# Altium project eth_bridge_v2.PrjPcb
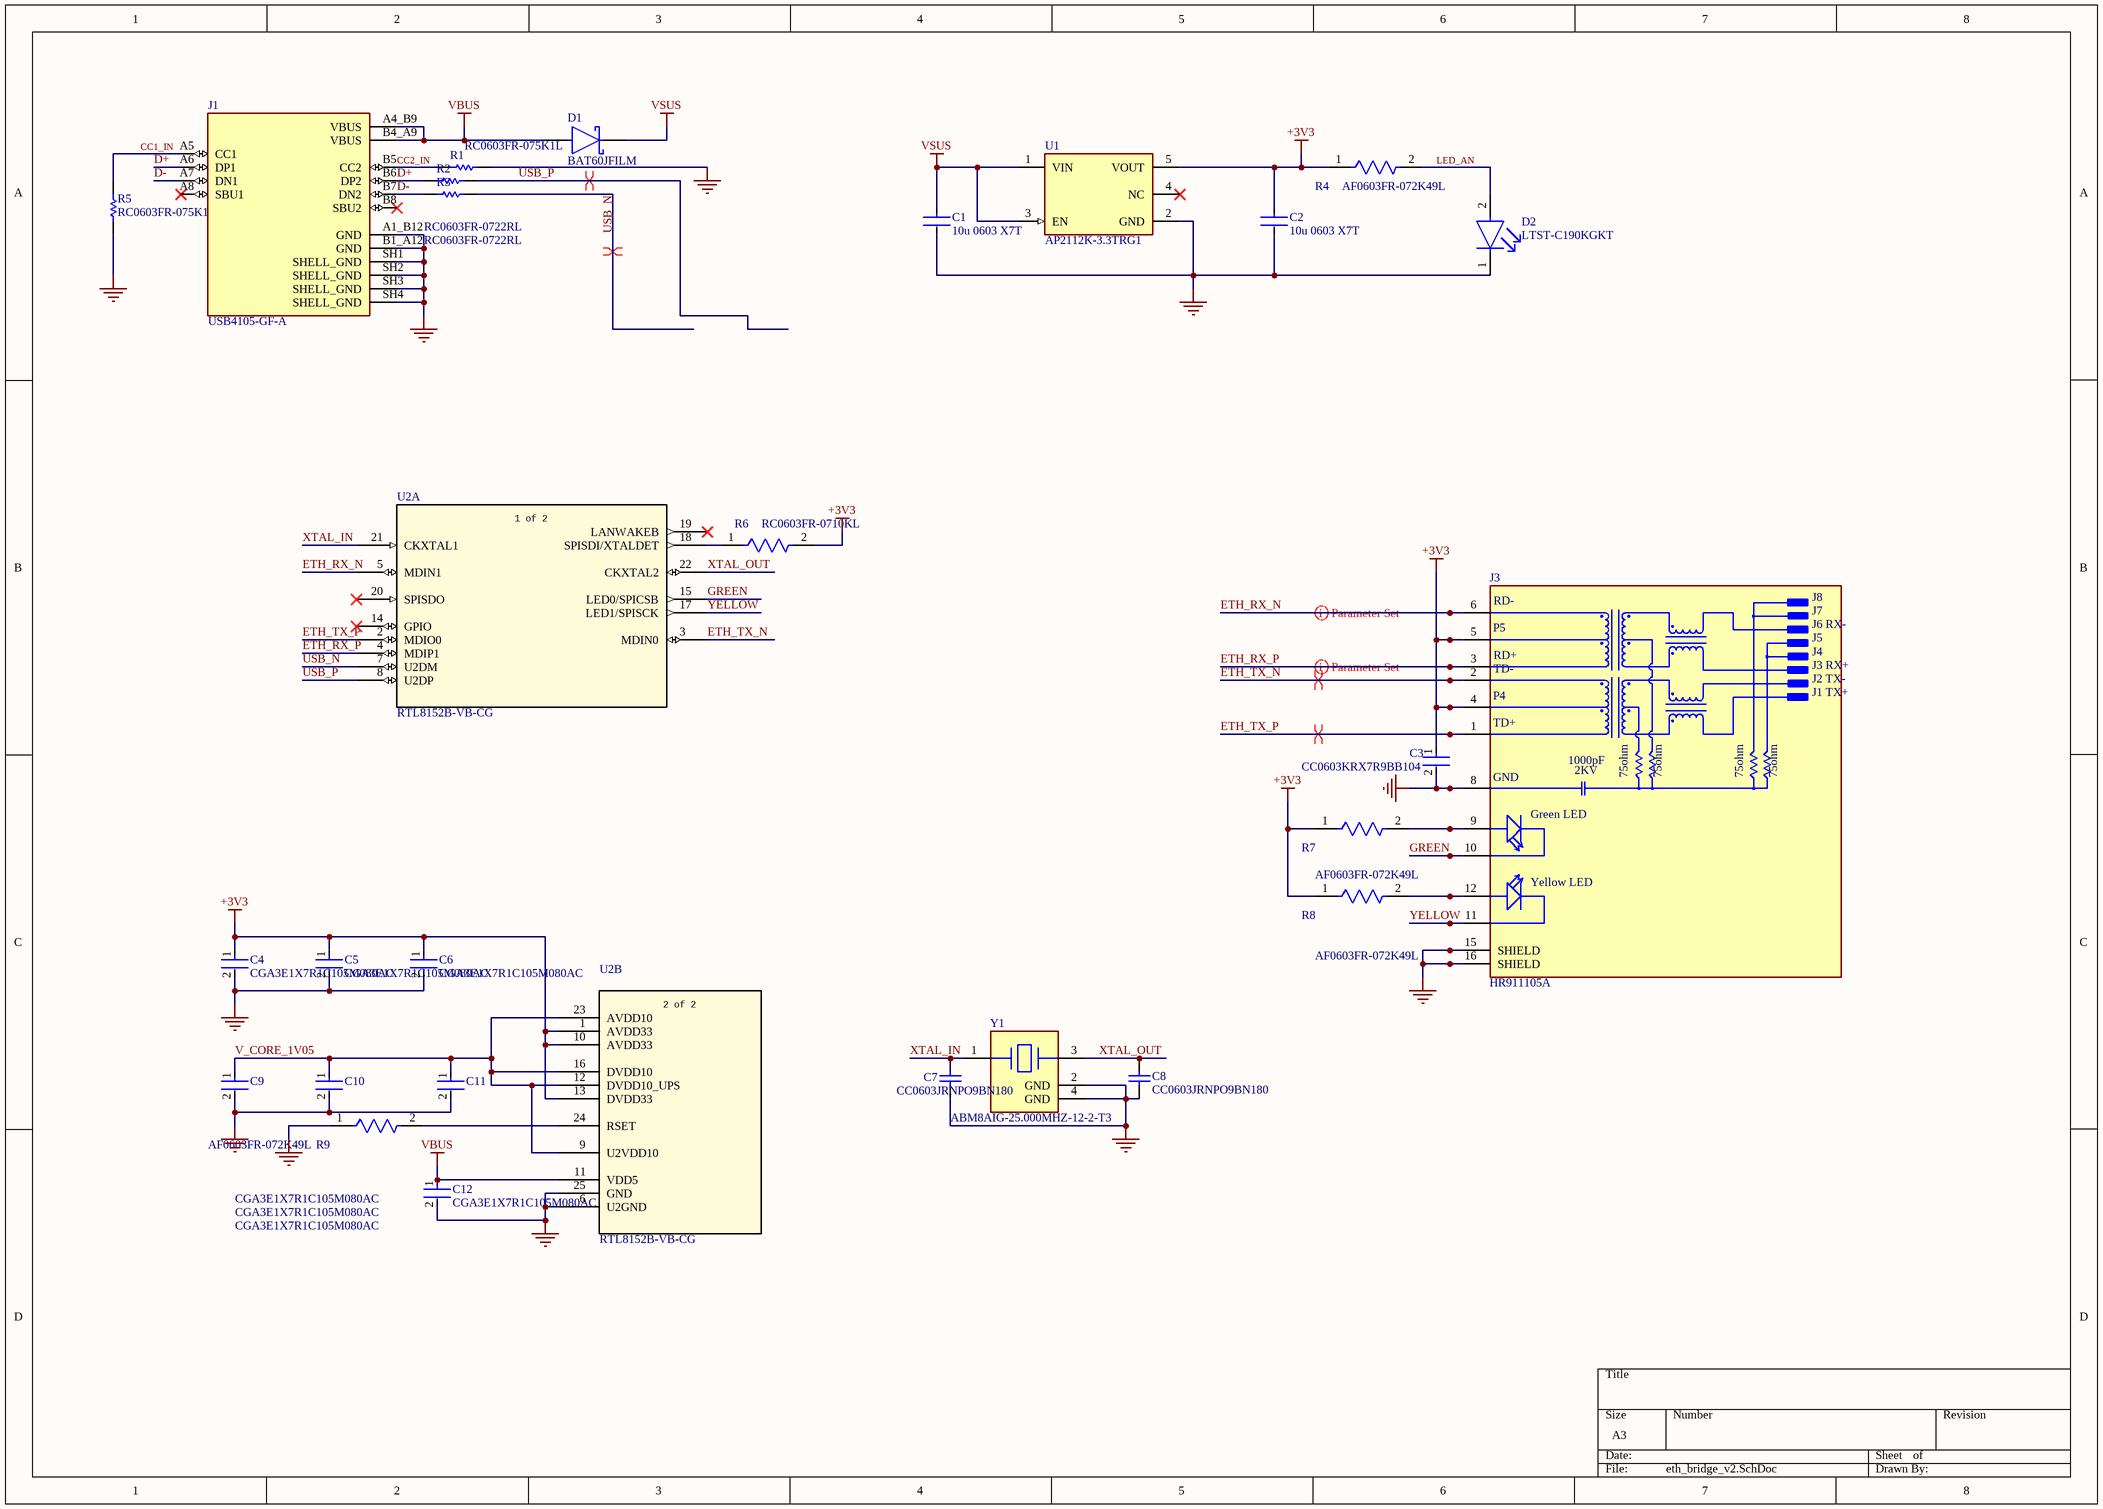
[diagram p0: eth_bridge_v2.SchDoc]
1 sheet, 28 parts. Net scope: global (net labels, ports and power ports of the same name join across sheets).
Board file: eth_bridge_v2_pcb.PcbDoc

## Sheet eth_bridge_v2.SchDoc
size A3; SheetNumber: 1; SheetTotal: 1

### Parts
C1  10u 0603 X7T  [FP-GRM188-0_2-IPC_C]
C2  10u 0603 X7T  [FP-GRM188-0_2-IPC_C]
C3  CC0603KRX7R9BB104  [FP-CC0603-DA-MFG]
C4  CGA3E1X7R1C105M080AC  [FP-CGA3E-0_3-0_1-IPC_B]
C5  CGA3E1X7R1C105M080AC  [FP-CGA3E-0_3-0_1-IPC_B]
C6  CGA3E1X7R1C105M080AC  [FP-CGA3E-0_3-0_1-IPC_B]
C7  CC0603JRNPO9BN180  [CAPC1608X90X40LL10T20]
C8  CC0603JRNPO9BN180  [CAPC1608X90X40LL10T20]
C9  CGA3E1X7R1C105M080AC  [FP-CGA3E-0_3-0_1-IPC_B]
C10  CGA3E1X7R1C105M080AC  [FP-CGA3E-0_3-0_1-IPC_B]
C11  CGA3E1X7R1C105M080AC  [FP-CGA3E-0_3-0_1-IPC_B]
C12  CGA3E1X7R1C105M080AC  [FP-CGA3E-0_3-0_1-IPC_B]
D1  BAT60JFILM  [FP-BAT60JFILM-MFG]
D2  LTST-C190KGKT  [FP-LTST-C190KGKT-MFG]
J1  USB4105-GF-A  [GCT_USB4105-GF-A]
J3  HR911105A  [HANRUN_HR911105A]
R1  RC0603FR-075K1L  [RESC1608X55X25ML10T15]
R2  RC0603FR-0722RL  [RESC1608X55X25NL10T15]
R3  RC0603FR-0722RL  [RESC1608X55X25NL10T15]
R4  AF0603FR-072K49L  [FP-AF0603-IPC_A]
R5  RC0603FR-075K1L  [RESC1608X55X25ML10T15]
R6  RC0603FR-0710KL  [FP-RC0603-0_55-IPC_C]
R7  AF0603FR-072K49L  [FP-AF0603-IPC_A]
R8  AF0603FR-072K49L  [FP-AF0603-IPC_A]
R9  AF0603FR-072K49L  [FP-AF0603-IPC_A]
U1  AP2112K-3.3TRG1  [FP-SOT25-IPC_A]
U2  RTL8152B-VB-CG  [RTL8152B-VB-CG_RTK]  (parts A,B of 2)
Y1  ABM8AIG-25.000MHZ-12-2-T3  [FP-ABM8AIG-MFG]

### Nets
+3V3: C2.1 C3.1 C4.1 C5.1 C6.1 J3.4(P4) J3.5(P5) R4.1 R6.2 R7.1 R8.1 U1.5(VOUT) U2.1(AVDD33) U2.10(AVDD33) U2.13(DVDD33)
GND: C1.2 C2.2 C3.2 C4.2 C5.2 C6.2 C7.1 C8.1 C9.2 C10.2 C11.2 C12.2 D2.1(C) J1.A1_B12(GND) J1.B1_A12(GND) J1.SH1(SHELL_GND) J1.SH2(SHELL_GND) J1.SH3(SHELL_GND) J1.SH4(SHELL_GND) J3.8(GND) J3.15(SHIELD) J3.16(SHIELD) R1.2 R5.1 R9.1 U1.2(GND) U2.6(U2GND) U2.25(GND) Y1.2(GND) Y1.4(GND)
VBUS: C12.1 D1.2(A) J1.A4_B9(VBUS) J1.B4_A9(VBUS) U2.11(VDD5)
VSUS: C1.1 D1.1(K) U1.1(VIN) U1.3(EN)
CC1_IN: J1.A5(CC1) R5.2
CC2_IN: J1.B5(CC2) R1.1
D+: J1.A6(DP1) J1.B6(DP2) R2.1
D-: J1.A7(DN1) J1.B7(DN2) R3.1
ETH_RX_N: J3.6(RD-) U2.5(MDIN1)
ETH_RX_P: J3.3(RD+) U2.4(MDIP1)
ETH_TX_N: J3.2(TD-) U2.3(MDIN0)
ETH_TX_P: J3.1(TD+) U2.2(MDIO0)
GREEN: J3.10(GC) U2.15(LED0/SPICSB)
LED_AN: D2.2(A) R4.2
USB_N: R3.2 U2.7(U2DM)
USB_P: R2.2 U2.8(U2DP)
V_CORE_1V05: C9.1 C10.1 C11.1 U2.9(U2VDD10) U2.12(DVDD10_UPS) U2.16(DVDD10) U2.23(AVDD10)
XTAL_IN: C7.2 U2.21(CKXTAL1) Y1.1
XTAL_OUT: C8.2 U2.22(CKXTAL2) Y1.3
YELLOW: J3.11(YC) U2.17(LED1/SPISCK)
NetJ3_9: J3.9(GA) R7.2
NetJ3_12: J3.12(YA) R8.2
NetR6_1: R6.1 U2.18(SPISDI/XTALDET)
NetR9_2: R9.2 U2.24(RSET)

Not connected (* = marked no-connect by the designer): J1 A8(SBU1)* B8(SBU2)*; U1 4(NC)*; U2 14(GPIO)* 19(LANWAKEB)* 20(SPISDO)*

### Layout directives
differential pair: ETH_RX_N, ETH_RX_P, ETH_TX_N, ETH_TX_P, USB_N, USB_P

### Notes on the sheet
- (in symbol CMP-002-00071-1) J8; J7; J6 RX-; J5; J4; J3 RX+; J2 TX-; J1 TX+; 1000pF; 2KV; 75ohm; Green LED; Yellow LED
- (in symbol RTL8152B-VB-CG, part A) 1 of 2
- (in symbol RTL8152B-VB-CG, part B) 2 of 2

### Library data of the parts
C1 C2 = CMP-06035-057161-1: 10uF 10V X7T 0603 20%; Voltage Rating: 10V; Weight: 0.000222oz; Mount: Surface Mount; Thickness: 0.039inch; Max Operating Temperature: 125°C; Width: 0.031inch; Capacitance: 10uF; Packaging: Tape and Reel; Case/Package: 0603; Min Operating Temperature: -55°C; Dielectric: X7T; Voltage Rating (DC): 10V; Tolerance: 20%; Length: 0.063inch; Package Quantity: 10000; Supplier 1: DigiKey; Supplier Part Number 1: 490-GRM188D71A106KA73JDKR-ND
C3 = CMP-2100-03601-2: CAP CER 0.1UF 50V X7R 0603; Manufacturer: YAGEO; Material: Ceramic; Capacitance: 100 nF; Temperature Coefficient: 15%; Tolerance: 0.1; Value: 100 nF; Description: CC0603 100 nF X7R 10.00% 50 V; Height: 0.9mm; Voltage: 50 V; ComponentLink2Description: Datasheet; Device Class L2: Capacitors; Temperature Range High: +125°C; Category: Cap; Footprint Url: http://www.yageo.com/exep/pages/download/literatures/UPY-C_GEN_24.pdf; ComponentLink2URL: http://www.yageo.com/documents/recent/UPY-GPHC_X7R_6.3V-to-50V_18.pdf; Package: CC0603-DA; Temperature: -55°C to +125°C; Voltage Rating: 50 V; Temperature Characteristic: X7R; Device Class L1: Passive Components; Temperature Range Low: -55°C; Manufacturer Part Number: CC0603KRX7R9BB104; RoHS: TRUE; Automotive: No; Device Class L3: Ceramic Capacitors; Octopart: https://octopart.com/cc0603krx7r9bb104-yageo-42244635; Mouser Description: Multilayer Ceramic Capacitor, CC Series, 0.1 - F, - 10%, X7R, 50 V, 0603 [1608 Metric]; Lead Free: Yes; Digikey Description: CAP CER 0.1UF 50V X7R 0603
C4-C6 C9-C12 = CMP-08246-001804-1: Cap Ceramic 1uF 16V X7R 20% Pad SMD 0603 +125°C Automotive T/R; Min Operating Temperature: -55°C; Lead Free: Lead Free; Voltage Rating: 16V; Voltage Rating (DC): 16V; Tolerance: 20%; Mount: Surface Mount; Dielectric: X7R; Case Code (Imperial): 0603; Max Operating Temperature: 125°C; Packaging: Tape and Reel; Termination: SMD/SMT; Weight: 7.1E-05oz; Package Quantity: 4000; Ratings: AEC-Q200; Thickness: 0.035inch; Case Code (Metric): 1608; Height: 0.8mm; Case/Package: 0603; Length: 0.063inch; Width: 0.031inch; Capacitance: 1uF
C7 C8 = CMP-1659-00030-1: Chip Capacitor, 18 pF, +/- 5%, 50 V, -55 to 125 degC, 0603 (1608 Metric), RoHS, Tape and Reel; Voltage Rating: 50 V; Case\Package: 0603; Power Rating: 100 mW; Resistance: 68.1 Ohm; Tolerance: 1%; Case Code (Metric): 1608; Max Operating Temperature: 155 degC; RoHSCompliant: true; Case Code (Imperial): 0603; ComponentLink2Description: Datasheet; Package Quantity: 200; PackageReference: 0603; ComponentLink2URL: http://www.yageo.com/NewPortal/yageodocoutput?fileName=/pdf/MLCC/UPY-GP_NP0_16V-to-50V_14.pdf; Length: 1.6 mm; DatasheetVersion: Rev. 14, 07/2016; Min Operating Temperature: -55 degC; ComponentLink1URL: http://www.yageo.com/; Width: 0.8 mm; ComponentLink1Description: Manufacturer URL; Height: 0.45 mm; Radiation Hardening: No; PackageDescription: 2-Pin Surface Mount Device, Body 1.6 x 0.8 mm; Packaging: Tape and Reel
D1 = CMP-12187-000028-1: SCHOTTKY 10V 3A SOD323; Max Forward Surge Current (Ifsm): 5A; Forward Voltage: 580mV; Max Reverse Leakage Current: 7.5uA; Element Configuration: Single; Polarity: Standard; Output Current: 3A; Contact Plating: Tin; Package Quantity: 1; Mount: Surface Mount; Min Operating Temperature: -65°C; Average Rectified Current: 3A; Packaging: Tape and Reel; Forward Current: 3A; Height: 1.07mm; Length: 1.8mm; REACH SVHC: No SVHC; Peak Non-Repetitive Surge Current: 5A; Max Surge Current: 5A; Width: 1.45mm; Current Rating: 3A; Lead Free: Lead Free; Radiation Hardening: No; Max Reverse Voltage (DC): 10V; Peak Reverse Current: 7.5uA; Voltage Rating (DC): 10V; Max Operating Temperature: 150°C; Max Repetitive Reverse Voltage (Vrrm): 10V; Number of Pins: 2; Weight: 0.01lb; Supplier 1: Future Electronics; Supplier Part Number 1: BAT60JFILM
D2 = CMP-2000-05197-2: LED GREEN CLEAR CHIP SMD; Test Current: 20mA; Power Rating: 75mW; Forward Voltage: 2V; Wavelength: 574nm; Number of LEDs: 1; Reverse Voltage: 5V; Dominant Wavelength: 571nm; Lens Style: Diffused; Luminous Intensity: 35mcd; Forward Current: 30mA; Viewing Angle: 130°; Lens Color: Colorless; Width: 0.8mm; Case Code (Imperial): 0603; Case Code (Metric): 1608; Number of Pins: 2; Radiation Hardening: No; Package Quantity: 1; Lead Free: Lead Free; Lens Transparency: Clear; Depth: 0.8mm; Power Dissipation: 75mW; Mount: Surface Mount; Max Operating Temperature: 85°C; Case/Package: 0603; Height: 0.8mm; Illumination Color: Green; Color: Green; Length: 1.6mm; Packaging: Tape and Reel; Number of Elements: 1; Min Operating Temperature: -55°C
J1 = CMP-007-000001-1: USB-C; MF: {'manufacturer': u'GCT'}; Pin Count: 16; Availability: Unavailable; MP: USB4105-GF-A; Design Item ID: USB4105-GF-A; Value: *; Package: None; Price: None; Component Type: Standard; Source: USB4105-GF-A.SchLib; Supplier 1: Future Electronics; Supplier Part Number 1: USB4105-GF-A
J3 = CMP-002-00071-1: DIP RJ45 Connector;; MF: hanrun; SnapEDA_Link: https://www.snapeda.com/parts/HR911105A/HanRun/view-part/?ref=snap; Case/Package: None; Component Type: Standard; Value: *; Source: HR911105A.SchLib; Pins: 13; MP: HR911105A; Availability: Not in stock; Price: None; Check_prices: https://www.snapeda.com/parts/HR911105A/HanRun/view-part/?ref=eda; Design Item ID: HR911105A; Component Type: Connectors
R1 R5 = CMP-2000-04091-1: Manufacturer: Yageo; Part Number: RC0603FR-075K1L
R2 R3 = CMP-1659-00033-1: Chip Resistor, 22 Ohm, +/- 1%, 0.1 W, -55 to 155 degC, 0603 (1608 Metric), RoHS, Tape and Reel; Max Ouput Current: 8 A; Case\Package: SIP; Max Input Voltage: 1.4 V; ComponentLink2URL: http://www.yageo.com/documents/recent/PYu-RC_Group_51_RoHS_L_04.pdf; RoHSCompliant: true; Max Operating Temperature: 100 degC; PackageDescription: 2-Pin Surface Mount Device, Body 1.6 x 0.8 mm; ComponentLink1Description: Manufacturer URL; ComponentLink1URL: http://www.yageo.com/; Length: 18.5 mm; REACH SVHC: Unknown; Pins: 4; DatasheetVersion: Rev. 4, 02/2016; PackageReference: 0603; Output Current: 8 A; Min Operating Temperature: -25 degC; Height: 19.6 mm; Mount: Through Hole; Radiation Hardening: No; ComponentLink2Description: Datasheet; Package Quantity: 200; Packaging: Rail/Tube
R4 R7-R9 = CMP-03412-039857-1: Anti-Sulfurated Chip Resistors Automotive Grade 2.49kΩ 1% 100ppm/°C 0603; Max Power Dissipation: 100mW; Resistance: 2.49kR; Packaging: Tape and Reel; Case/Package: 0603; Height: 0.022inch; Features: Moisture Resistant; Number of Terminations: 2; Length: 0.063inch; Tolerance: 1%; Resistor Type: Thick Film; Width: 0.031inch; Max Operating Temperature: 155°C; Temperature Coefficient: 100ppm/°C; Min Operating Temperature: -55°C; Series: AF; RoHS Compliant: Yes
R6 = CMP-2100-03664-2: RES 10K OHM 1% 1/10W 0603; Voltage Rating: 75V; Voltage Rating (DC): 50V; Resistance: 10kR; Power Rating: 100mW; Temperature Coefficient: 100ppm/°C; Depth: 0.8mm; Termination: SMD/SMT; Resistor Type: Thick Film; Series: RC; Construction: Rectangular; Features: Moisture Resistant; Packaging: Tape and Reel; Min Operating Temperature: -55°C; Number of Terminations: 2; Lead Pitch: 0.3mm; RoHS Compliant: Yes; Case/Package: 0603; Resistance Tolerance: 1%; Military Standard: Not; Weight: 7.1E-05oz; Number of Pins: 2; Tolerance: 1%; Length: 1.6mm; Case Code (Imperial): 0603; Lead Free: Lead Free; Width: 0.8mm; Max Power Dissipation: 100mW; Height: 0.45mm; Max Operating Temperature: 155°C; Case Code (Metric): 1608; Size Code: 0603
U1 = CMP-12756-000035-1: LDO 3.3V 600MA SOT25; Number of Regulators: 1; Output Type: Fixed; Polarity: Positive; Min Input Voltage: 2.5V; Max Input Voltage: 6V; Accuracy: 1.5%; Quiescent Current: 55uA; Dropout Voltage: 250mV; Min Operating Temperature: -40°C; Length: 3.1mm; Output Current: 600mA; Max Operating Temperature: 85°C; Package Quantity: 1; Output Voltage: 3.3V; Width: 1.7mm; Number of Outputs: 1; Packaging: Tape and Reel; Height: 1.3mm; Lead Free: Lead Free; Max Output Current: 600mA; Case/Package: SOT-23-5; Mount: Surface Mount; Number of Pins: 5; Supplier 1: Avnet; Supplier Part Number 1: AP2112K-3.3TRG1
U2 = RTL8152B-VB-CG: Description; Manufacturer_Name: Realtek; Copyright: Copyright (C) 2026 Ultra Librarian. All rights reserved.; Manufacturer_Part_Number: RTL8152B-VB-CG; RefDes: RefDes; Type: Type
Y1 = CMP-27762-015150-1: Crystal 25MHz ±20ppm (Tol) ±100ppm (Stability) 12pF FUND 50Ω Automotive 4-Pin Ultra Mini-CSMD T/R; ESR (Equivalent Series Resistance): 50R; RoHS Compliant: Yes; Frequency Stability: 100ppm; Min Operating Temperature: -40°C; Frequency Tolerance: 20ppm; Case/Package: SMD/SMT; Packaging: Tape and Reel; Ratings: AEC-Q200; Series: ABM8AIG; Mount: Surface Mount; Load Capacitance: 12pF; Height: 0.031inch; Length: 0.126inch; Frequency: 25MHz; Width: 0.098inch; Max Operating Temperature: 125°C